# EasyEDA schematic LcsNodes-Building-Block-RailCom-Detector.json
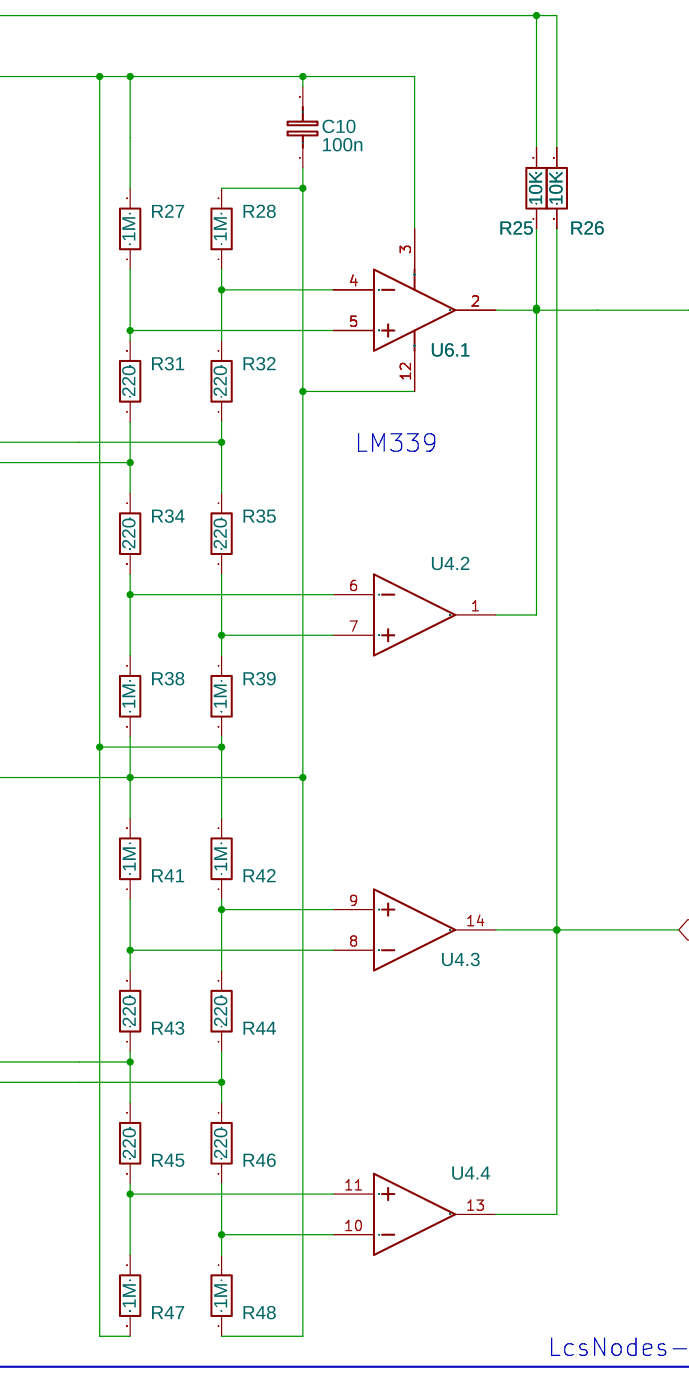
[diagram p0: schematic sheet]

## Parts
C10  100n  [C1206]
R25  10K  [R1206]
R26  10K  [R1206]
R27  1M  [R1206]
R28  1M  [R1206]
R31  220  [R1206]
R32  220  [R1206]
R34  220  [R1206]
R35  220  [R1206]
R38  1M  [R1206]
R39  1M  [R1206]
R41  1M  [R1206]
R42  1M  [R1206]
R43  220  [R1206]
R44  220  [R1206]
R45  220  [R1206]
R46  220  [R1206]
R47  1M  [R1206]
R48  1M  [R1206]
U4  LM339ADR  [SO-14_L8.6-W3.9-P1.27-LS6.0-BL]  (sections 2,3,4)
U6  LM339ADR  [SO-14_L8.6-W3.9-P1.27-LS6.0-BL]  (section 1)

## Library data of the parts
C10 = C_0603_EU: Contributor: LCEDA_Lib; Package Display: No
R25-R28 R31 R32 R34 R35 R38 R39 R41-R48 = R_AXIAL-0.3_EU: Contributor: LCEDA_Lib
U4 U6 = LM339ADR: Supplier Part: C74559; Supplier: LCSC; Manufacturer Part: TI; subpart_no: 1; JLCPCB Part Class: Extended Part

## Nets
GND: C10.1 R28.2 R38.2 R41.2 R48.2 U6.12(GND)
VCC-3V3: R25.2 R26.1
IN-0-1: R32.1 R35.1
IN-0-2: R31.1 R34.1
IN-1-1: R43.1 R45.1
IN-1-2: R44.1 R46.1
RC-0: R25.1 U4.1(OUT1) U6.2(OUT2)
RC-1: R26.2 U4.13(OUT4) U4.14(OUT3)
VS: C10.2 R27.2 R39.2 R42.2 R47.2 U6.3(VCC)
Net-(R27-1): R27.1 R31.2 U6.5(IN2+)
Net-(R28-1): R28.1 R32.2 U6.4(IN2-)
Net-(R34-2): R34.2 R38.1 U4.6(IN1-)
Net-(R35-2): R35.2 R39.1 U4.7(IN1+)
Net-(R41-1): R41.1 R43.2 U4.8(IN3-)
Net-(R42-1): R42.1 R44.2 U4.9(IN3+)
Net-(R45-2): R45.2 R47.1 U4.11(IN4+)
Net-(R46-2): R46.2 R48.1 U4.10(IN4-)

## Notes on the sheet
- LM339
- LcsNodes-Dual-RailCom-Detector
